# EasyEDA Pro project ProPrj_ElectronicSteatTagV6_2026-03-17.epro

# Schematic Schematic1
Create Date: 2025-06-14; Page Name: P1; Project Name: ElectronicSteatTagV6; Schematic Name: Schematic1; Update Date: 2025-07-07; Company: 嘉立创EDA; Page Size: A4; Version: V1.0
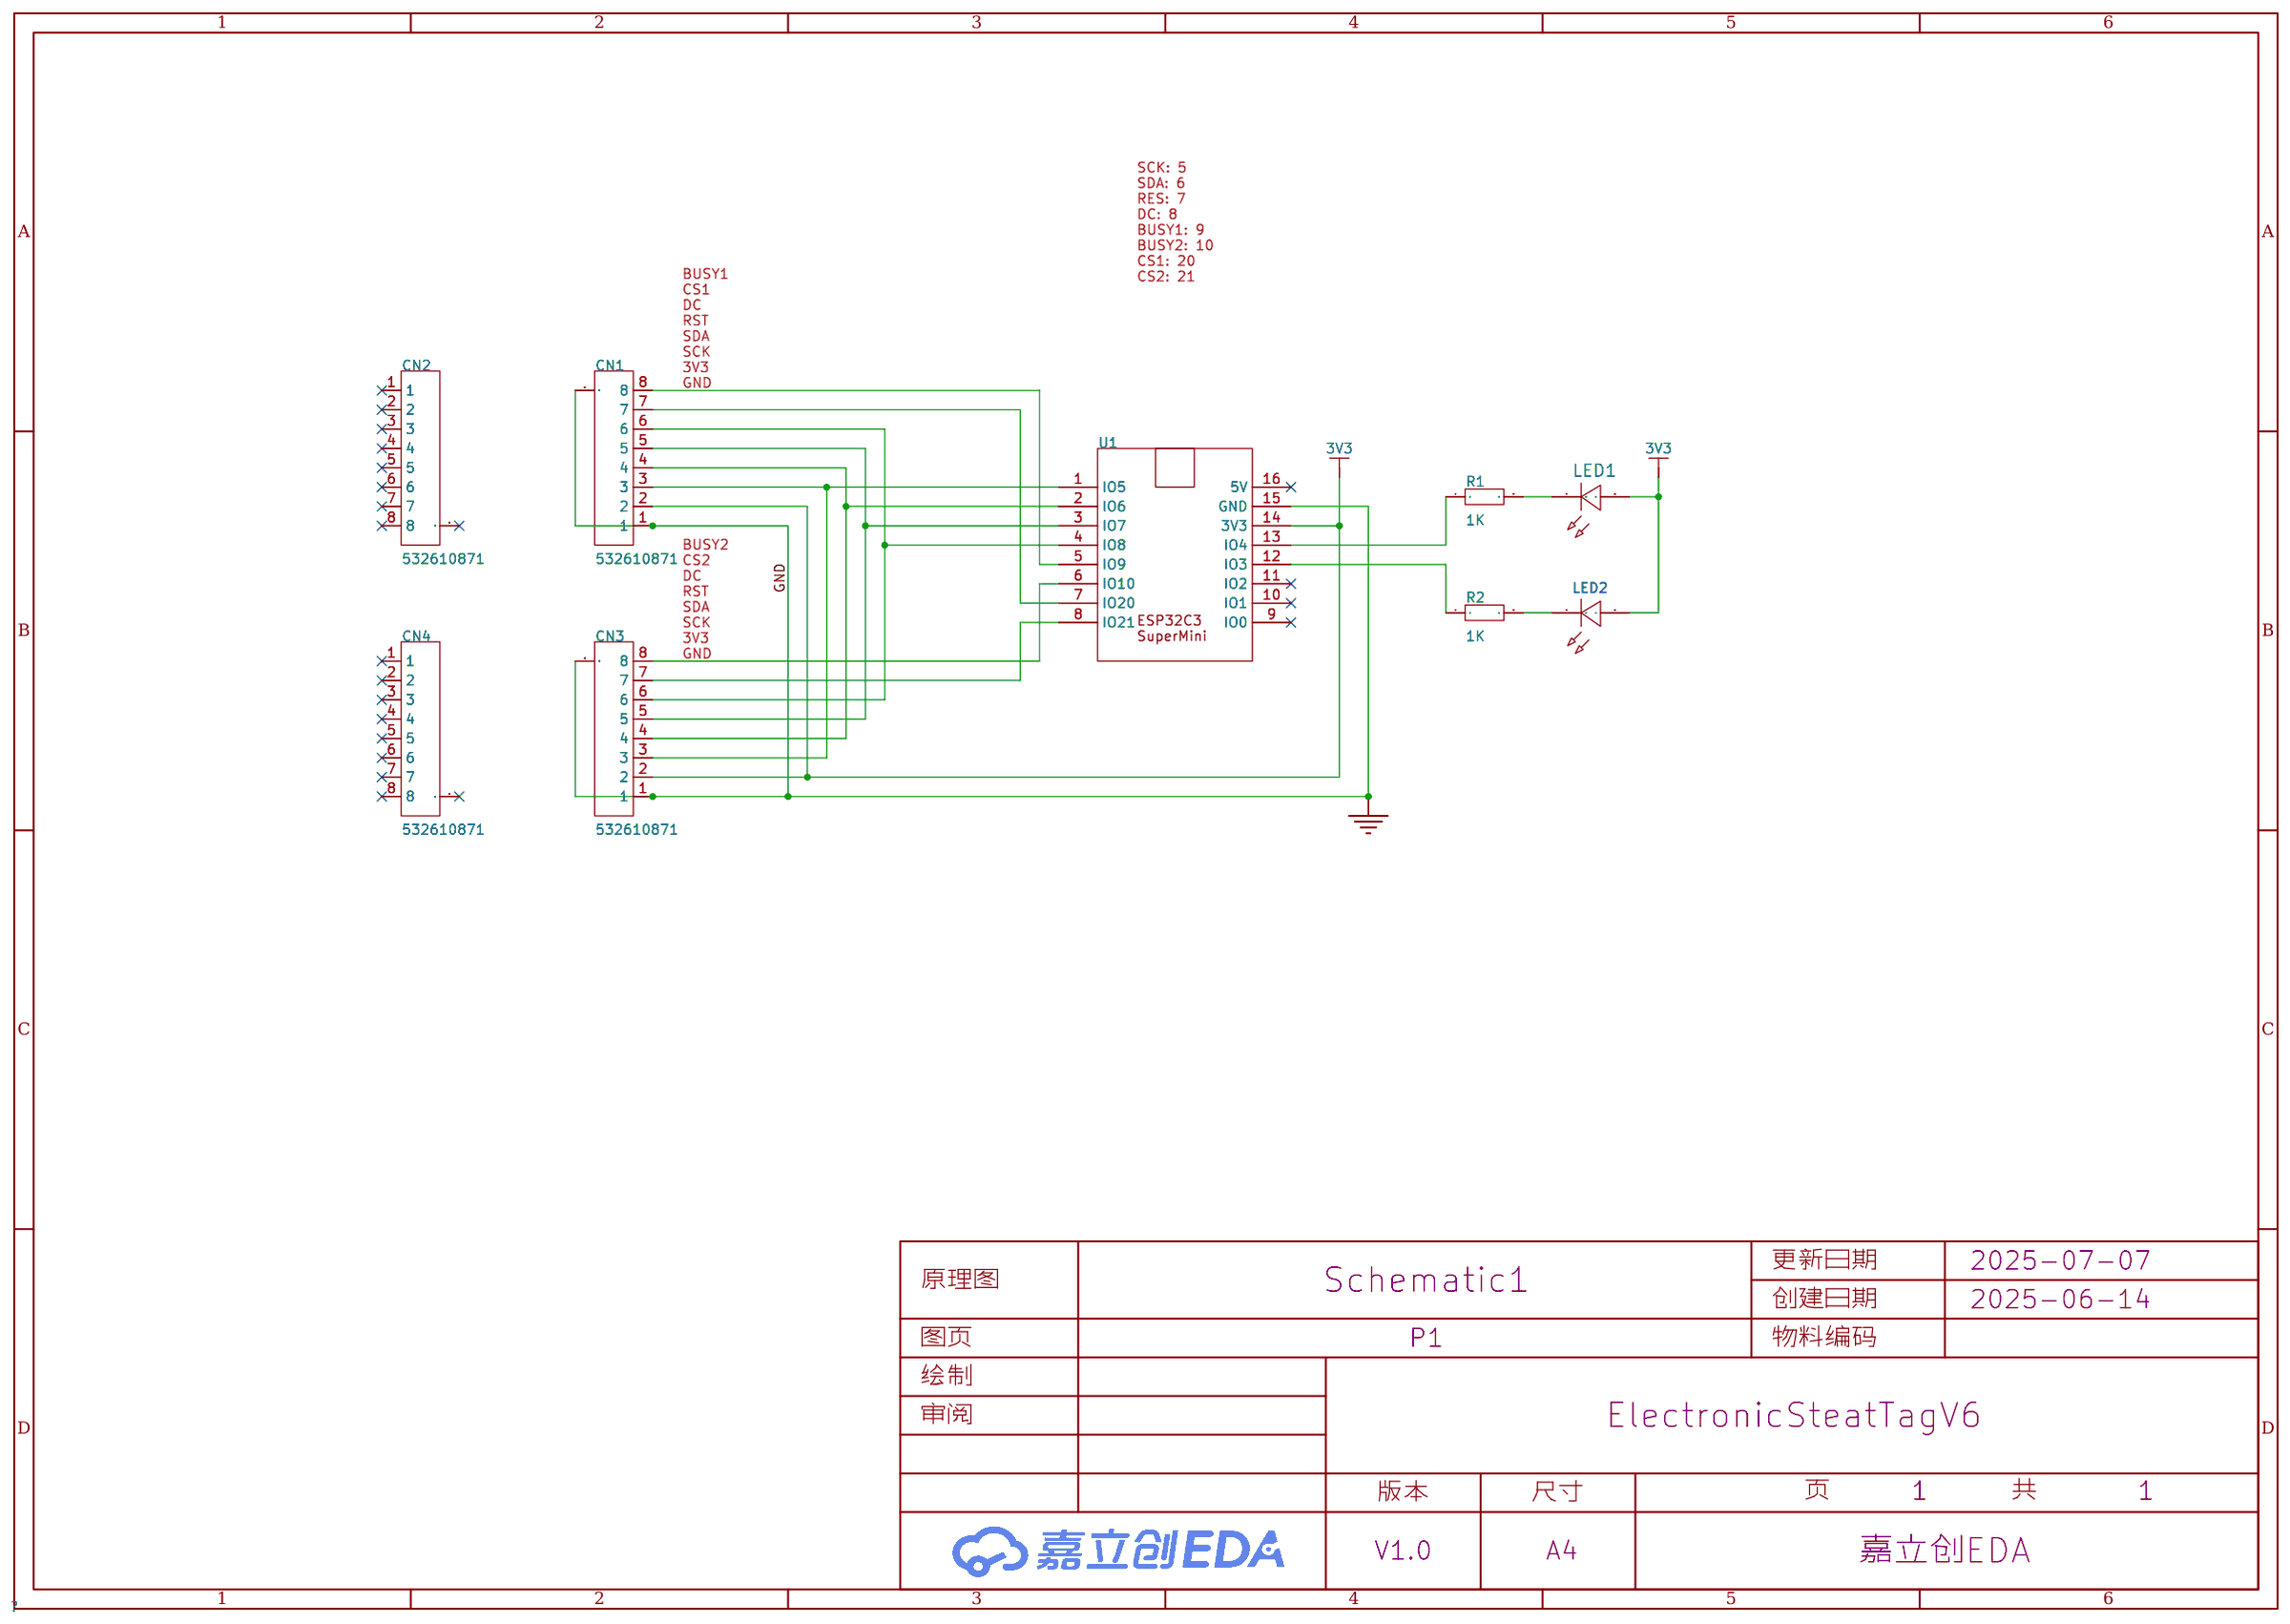
[diagram p0: schematic sheet]

## Parts
CN1  532610871  [CONN-SMD_532610871]
CN2  532610871  [CONN-SMD_532610871]
CN3  532610871  [CONN-SMD_532610871]
CN4  532610871  [CONN-SMD_532610871]
LED1  -  [LED_0805]
LED2  -  [LED_0805]
R1  1K  [R0805]
R2  1K  [R0805]
U1  -  [ESP32C3SuperMini]

## Library data of the parts
CN1-CN4 = 532610871: 插针结构:1x8P;间距:1.25mm;安装方式:卧贴;参考系列:PicoBlade(MX 1.25);总PIN数:8P;排数:1;每排PIN数:8;行距:-;额定电流:1A;触头材质:磷青铜;触头镀层:锡;工作温度:-40℃~+105℃;; LCSC Part Name: 1x8P 间距:1.25mm 卧贴 系列:PicoBlade(MX 1.25); Supplier Part: C293349; Manufacturer: MOLEX; Supplier Footprint: SMD,P=1.25mm; JLCPCB Part Class: 扩展库; Datasheet: https://www.molex.com/content/dam/molex/molex-dot-com/products/automated/en-us/salesdrawingpdf/532/53261/532610871_sd.pdf?inline\; Supplier: LCSC; Pins Structure: 1x8P; Pitch: 1.25mm; Mounting Type: 卧贴; Reference Series: PicoBlade(MX 1.25); Number of Pins: 8P; Number of Rows: 1; Number of PINs Per Row: 8; Current Rating: 1A; Contact Material: 磷青铜; Contact Plating: 锡; Operating Temperature: -40℃~+105℃; Voltage Rating: 125V; Plastic Material: 玻纤增强PA; Flame Retardant Rating: UL94V-0; Supplementary Features: 辅助焊脚; Color: 白色; Z-Height of the Board: 3.4mm; X-Length of Bottom Edge on Board (Spacing Line): 15.15mm; Y-Width of Bottom Edge on Board: 5.2mm
LED1 = LED_0805-R: Supplier Footprint: 0805
LED2 = LED_0805-B: Supplier Footprint: 0805
R1 R2 = Res_0805: Supplier Footprint: 0805
U1 = ESP32C3SuperMini

## Nets
3V3: CN1.2 CN3.2 LED1.2(A) LED2.2(A) U1.14(3V3)
GND: CN1.0 CN1.1 CN3.0 CN3.1 U1.15(GND)
$1N1581: CN1.8 U1.5(IO9)
$1N1589: CN3.8 U1.6(IO10)
$1N1597: CN3.7 U1.8(IO21)
$1N1650: CN1.3 CN3.3 U1.1(IO5)
$1N1662: CN1.5 CN3.5 U1.3(IO7)
$1N1671: CN1.6 CN3.6 U1.4(IO8)
$1N1680: CN1.7 U1.7(IO20)
$1N1928: R1.1 U1.13(IO4)
$1N1932: LED1.1(C) R1.2
$1N1940: R2.1 U1.12(IO3)
$1N1944: LED2.1(C) R2.2
$1N2158: CN1.4 CN3.4 U1.2(IO6)

Not connected (* = marked no-connect by the designer): CN2 0* 1* 2* 3* 4* 5* 6* 7* 8*; CN4 0* 1* 2* 3* 4* 5* 6* 7* 8*; U1 9(IO0)* 10(IO1)* 11(IO2)* 16(5V)*

## Notes on the sheet
- SCK: 5
  SDA: 6
  RES: 7
  DC: 8
  BUSY1: 9
  BUSY2: 10
  CS1: 20
  CS2: 21
- BUSY1
  CS1
  DC
  RST
  SDA
  SCK
  3V3
  GND
- BUSY2
  CS2
  DC
  RST
  SDA
  SCK
  3V3
  GND

# Board PCB1
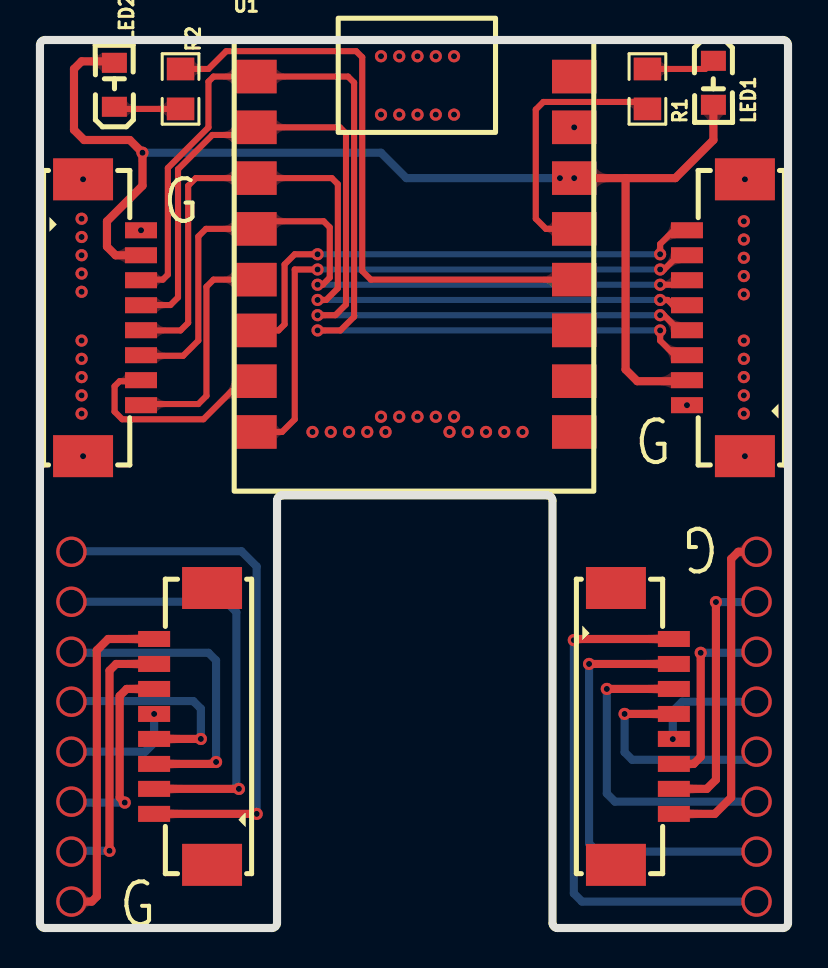
[diagram p1: board, top side]
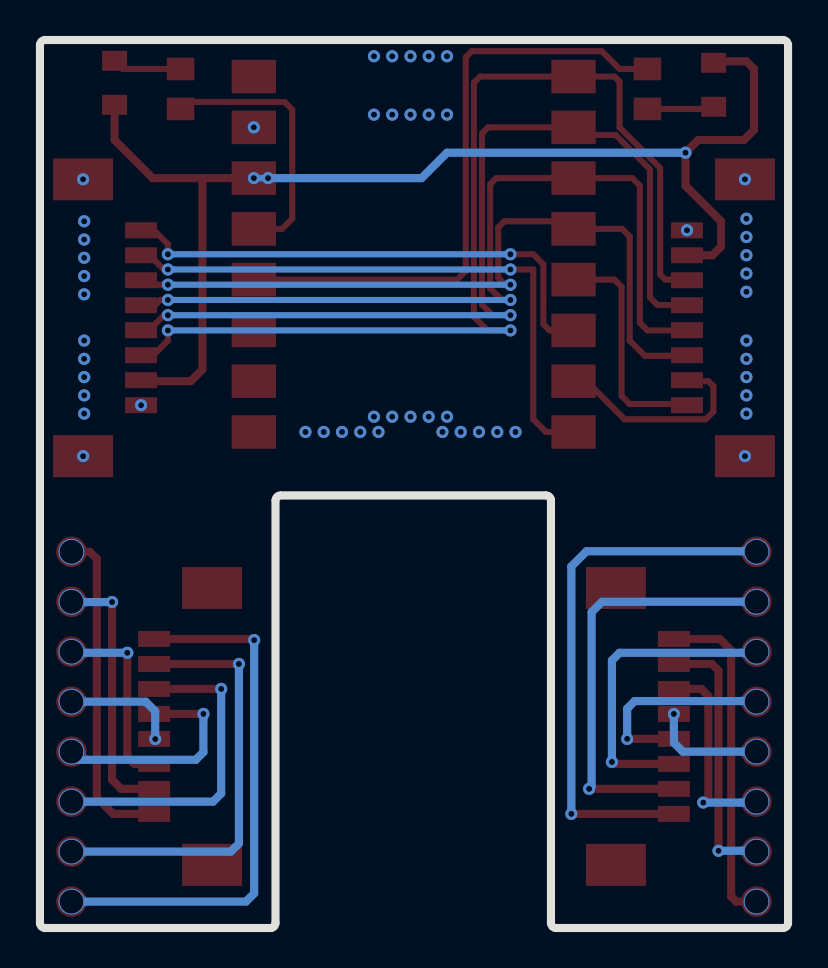
[diagram p2: board, bottom side, seen from below]

Outline 37.44 x 44.43 mm; copper layers: Top Layer, Bottom Layer. Coordinates in mm from the lower left corner of the outline.
Outline path: 0,44.17 arc(0.07,44.35) 0.25,44.43 37.19,44.43 arc(37.37,44.35) 37.44,44.17 37.44,0.25 arc(37.37,0.07) 37.19,0 25.91,0 arc(25.73,0.07) 25.65,0.25 25.65,21.39 arc(25.58,21.57) 25.4,21.64 12.12,21.64 arc(11.94,21.57) 11.87,21.39 11.87,0.25 arc(11.79,0.07) 11.61,0 0.25,0 arc(0.07,0.07) 0,0.25 0,44.17
Stack: Top Layer 0.035mm / Dielectric1 1.51mm FR4 er 4.5 / Bottom Layer 0.035mm

## Design rules (mm)
template: JLCPCB Capability(Two Layers Board)
spacing copperThickness1oz (default): track to track 0.102, other pairs 0.152 to 0.3
spacing copperThickness2oz: track to track 0.203, other pairs 0.152 to 0.3
track width copperThickness1oz (default): min 0.127, default 0.254, max 2.54
track width copperThickness2oz: min 0.203, default 0.254, max 2.54
differential pair differentialPair (default): width min 0.127, default 0.254, max 2.54; gap min 0.152, default 0.152
via viaSize (default): diameter min 0.5, default 0.61, max 10; hole min 0.3, default 0.305, max 6.3

## Placement (name value [footprint] x y rotation side)
CN1  532610871  [CONN-SMD_532610871]  3.61 30.53 270 top
CN2  532610871  [CONN-SMD_532610871]  7.16 10.09 90 top
CN3  532610871  [CONN-SMD_532610871]  33.83 30.53 90 top
CN4  532610871  [CONN-SMD_532610871]  30.28 10.09 270 top
LED1  -  [LED_0805]  33.7 42.23 270 top
LED2  -  [LED_0805]  3.73 42.23 90 top
NOREF  -  [Pad_e14]  1.58 16.32 0 top
NOREF#2  -  [Pad_e20]  1.58 8.82 0 top
NOREF#3  -  [Pad_e38]  35.87 6.32 0 top
NOREF#4  -  [Pad_e28]  35.87 18.82 0 top
NOREF#5  -  [Pad_e42]  35.87 1.32 0 top
NOREF#6  -  [Pad_e24]  1.58 3.82 0 top
NOREF#7  -  [Pad_e12]  1.58 18.82 0 top
NOREF#8  -  [Pad_e36]  35.87 8.82 0 top
NOREF#9  -  [Pad_e34]  35.87 11.32 0 top
NOREF#10  -  [Pad_e18]  1.58 11.32 0 top
NOREF#11  -  [Pad_e40]  35.87 3.82 0 top
NOREF#12  -  [Pad_e16]  1.58 13.82 0 top
NOREF#13  -  [Pad_e22]  1.58 6.32 0 top
NOREF#14  -  [Pad_e30]  35.87 16.32 0 top
NOREF#15  -  [Pad_e26]  1.58 1.32 0 top
NOREF#16  -  [Pad_e32]  35.87 13.82 0 top
R1  1K  [R0805]  30.41 41.98 90 top
R2  1K  [R0805]  7.04 41.98 270 top
U1  -  [ESP32C3SuperMini]  9.72 44.38 0 top

## Footprints (pads in the part's own frame, mm; a bottom-side part is the same pattern mirrored in y, then rotated)
CONN-SMD_532610871
  rect 2.1x3 smd: 0(-6.925,-1.45) 0(6.925,-1.45)
  rect 0.8x1.6 smd: 1(-4.375,1.45) 2(-3.125,1.45) 3(-1.875,1.45) 4(-0.625,1.45) 5(0.625,1.45) 6(1.875,1.45) 7(3.125,1.45) 8(4.375,1.45)
ESP32C3SuperMini
  rect 2.22x1.68 smd: 1(1.016,-1.778) 2(1.016,-4.318) 3(1.016,-6.858) 4(1.016,-9.398) 5(1.016,-11.938) 6(1.016,-14.478) 7(1.016,-17.018) 8(1.016,-19.558) 9(17.018,-19.558) 10(17.018,-17.018) 11(17.018,-14.478) 12(17.018,-11.938) 13(17.018,-9.398) 14(17.018,-6.858) 15(17.018,-4.318) 16(17.018,-1.778)
LED_0805
  rect 1x1.25 smd: 1(-1.15,0.005) 2(1.05,0.005)
Pad_e12
  round 1.524 smd: 0(0,0)
Pad_e14
  round 1.524 smd: 4(0,0)
Pad_e16
  round 1.524 smd: 0(0,0)
Pad_e18
  round 1.524 smd: 2(0,0)
Pad_e20
  round 1.524 smd: 1(0,0)
Pad_e22
  round 1.524 smd: 6(0,0)
Pad_e24
  round 1.524 smd: 5(0,0)
Pad_e26
  round 1.524 smd: 3(0,0)
Pad_e28
  round 1.524 smd: 0(0,0)
Pad_e30
  round 1.524 smd: 4(0,0)
Pad_e32
  round 1.524 smd: 0(0,0)
Pad_e34
  round 1.524 smd: 2(0,0)
Pad_e36
  round 1.524 smd: 1(0,0)
Pad_e38
  round 1.524 smd: 6(0,0)
Pad_e40
  round 1.524 smd: 5(0,0)
Pad_e42
  round 1.524 smd: 3(0,0)
R0805
  rect 1.133x1.377 smd: 1(-1,0) 2(1,0)

## Nets
As in the schematic.

Pads without a net: CN2 0 1 2 3 4 5 6 7 8; CN4 0 1 2 3 4 5 6 7 8; NOREF 4; NOREF#2 1; NOREF#3 6; NOREF#4 0; NOREF#5 3; NOREF#6 5; NOREF#7 0; NOREF#8 1; NOREF#9 2; NOREF#10 2; NOREF#11 5; NOREF#12 0; NOREF#13 6; NOREF#14 4; NOREF#15 3; NOREF#16 0; U1 9 10 11 16

## Via types
v1: diameter 1.3, hole 1.2, Top Layer to Bottom Layer, 16 vias
v2: diameter 0.61, hole 0.305, Top Layer to Bottom Layer, 81 vias

## Routing (per net, layer and track width the routed paths; a pad name or vN(x,y) marks a point on that pad's centre or on a via; arc(x,y) is an arc through that point)
3V3: length 61
  Top Layer w0.406: CN3.2 32.33,27.36 29.9,27.36 29.31,27.94 29.31,37.52 ; CN1.2 3.79,33.66 3.35,34.09 3.35,35.36 5.13,37.14 v2(5.13,38.79) 4.5,39.42 2.21,39.42 1.7,39.93 1.7,42.98 2.08,43.36 3.65,43.36 LED2.2 ; v2(26.74,37.52) 29.31,37.52 ; 29.31,37.52 31.8,37.52 33.71,39.42 LED1.2
  Bottom Layer w0.305: v2(26.03,37.52) v2(26.74,37.52)
  Bottom Layer w0.406: v2(5.13,38.79) 17.07,38.79 18.34,37.52 v2(26.03,37.52)
GND:
  vias: v2(2.16,37.46) v2(2.08,35.49) v2(2.08,34.57) v2(2.08,33.66) v2(2.08,32.74) v2(2.08,31.83) v2(2.08,29.39) v2(2.08,28.48) v2(2.08,27.56) v2(2.08,26.65) v2(2.08,25.73) v2(2.16,23.61) v2(5.06,34.91) v2(13.64,24.82) v2(14.56,24.82) v2(15.47,24.82) v2(16.38,24.82) v2(17.07,43.61) v2(17.07,40.69) v2(17.07,25.58) v2(17.3,24.82) v2(17.98,43.61) v2(17.98,40.69) v2(17.98,25.58) v2(18.9,43.61) v2(18.9,40.69) v2(18.9,25.58) v2(19.81,43.61) v2(19.81,40.69) v2(19.81,25.58) v2(20.5,24.82) v2(20.73,43.61) v2(20.73,40.69) v2(20.73,25.58) v2(21.41,24.82) v2(22.33,24.82) v2(23.24,24.82) v2(24.16,24.82) v2(26.74,40.06) v2(32.38,26.16) v2(35.23,35.36) v2(35.23,34.44) v2(35.23,33.53) v2(35.23,32.62) v2(35.23,31.7) v2(35.23,29.39) v2(35.23,28.48) v2(35.23,27.56) v2(35.23,26.65) v2(35.23,25.73) v2(35.28,37.46) v2(35.28,23.61)
(no net): length 242.2
  Top Layer w0.406: v2(33.07,13.77) 33.07,8.56 32.72,8.21 CN4.6 ; CN4.8 33.78,5.71 34.6,6.53 34.6,18.47 34.95,18.82 v1(35.87,18.82) ; 5.71,8.21 8.72,8.21 v2(8.82,8.31) ; 5.71,13.21 3.81,13.21 3.48,12.88 v2(3.48,3.86) ; 5.71,14.46 3.41,14.46 2.85,13.9 2.85,1.58 2.59,1.32 v1(1.58,1.32) ; CN4.1 26.78,14.46 v2(26.72,14.4) ; CN4.7 33.38,6.96 33.83,7.42 v2(33.83,16.31) ; 5.71,9.46 v2(8.05,9.46) ; v2(31.68,9.45) 31.72,9.45 CN4.5 ; 5.71,11.96 4.34,11.96 3.99,11.61 3.99,6.53 v2(4.24,6.28) ; CN4.4 v2(29.26,10.71) ; CN4.3 v2(28.37,11.96) ; 5.71,6.96 v2(9.96,6.96) ; CN4.2 v2(27.48,13.21) ; 5.71,5.71 v2(10.85,5.71)
  Bottom Layer w0.406: v2(4.24,6.28) 1.62,6.28 v1(1.58,6.32) ; v2(5.71,10.71) 5.71,9.27 5.27,8.82 v1(1.58,8.82) ; v1(35.87,6.32) 28.78,6.32 28.37,6.73 v2(28.37,11.96) ; v1(35.87,1.32) 27.13,1.32 26.72,1.73 v2(26.72,14.4) ; v2(33.83,16.31) 35.85,16.31 v1(35.87,16.32) ; v2(31.68,9.45) 31.68,10.85 32.15,11.32 v1(35.87,11.32) ; v2(33.07,13.77) 35.81,13.77 v1(35.87,13.82) ; v2(3.48,3.86) 1.62,3.86 v1(1.58,3.82) ; v2(29.26,10.71) 29.26,8.8 29.64,8.42 35.46,8.42 v1(35.87,8.82) ; v2(8.05,9.46) 8.05,10.97 7.67,11.36 1.61,11.36 v1(1.58,11.32) ; v2(10.85,5.71) 10.85,18.09 10.09,18.85 1.6,18.85 v1(1.58,18.82) ; v2(27.48,13.21) 27.48,4.23 27.89,3.82 v1(35.87,3.82) ; v1(1.58,13.82) 1.63,13.77 8.43,13.77 8.82,13.39 v2(8.82,8.31) ; v1(1.58,16.32) 9.31,16.32 9.83,15.8 9.83,7.09 v2(9.96,6.96)
$1N1581: length 11.5
  Top Layer w0.305: CN1.8 5.12,26.21 7.93,26.21 8.33,26.62 8.33,32.08 8.69,32.44 U1.5
$1N1589: length 25.8
  Top Layer w0.305: v2(31.04,33.71) 31.04,34.22 31.73,34.91 CN3.8 ; U1.6 11.94,29.9 12.24,30.2 12.24,33.2 12.75,33.71 v2(13.9,33.71)
  Bottom Layer w0.305: v2(31.04,33.71) v2(13.9,33.71)
$1N1597: length 29.7
  Top Layer w0.305: CN3.7 31.95,33.66 31.24,32.95 v2(31.04,32.95) ; U1.8 12.12,24.82 12.75,25.45 12.75,32.95 v2(13.9,32.95)
  Bottom Layer w0.305: v2(31.04,32.95) v2(13.9,32.95)
$1N1650: length 52.6
  Top Layer w0.305: CN3.3 31.77,28.66 31.04,29.39 v2(31.04,29.9) ; CN1.3 5.09,32.44 6.15,32.44 6.4,32.69 6.4,38.02 8.43,40.06 8.43,42.34 8.69,42.6 U1.1 15.42,42.6 15.72,42.29 15.72,30.58 15.04,29.9 v2(13.9,29.9)
  Bottom Layer w0.305: v2(31.04,29.9) v2(13.9,29.9)
$1N1662: length 42.2
  Top Layer w0.305: CN3.5 31.69,31.16 31.42,31.42 v2(31.04,31.42) ; v2(13.9,31.42) 14.33,31.42 14.91,32.01 14.91,37.21 14.61,37.52 U1.3 7.8,37.52 7.42,37.14 7.42,30.28 7.04,29.9 5.07,29.9 CN1.5
  Bottom Layer w0.305: v2(31.04,31.42) v2(13.9,31.42)
$1N1671: length 37.3
  Top Layer w0.305: v2(13.9,32.18) 14.15,32.18 14.51,32.54 14.51,35.05 14.2,35.36 11.12,35.36 U1.4 8.31,34.98 7.93,34.6 7.93,29.39 7.16,28.63 5.09,28.63 CN1.6 ; v2(31.04,32.18) 32.16,32.18 CN3.6
  Bottom Layer w0.305: v2(31.04,32.18) v2(13.9,32.18)
$1N1680: length 10.7
  Top Layer w0.305: U1.7 10.09,27.36 8.18,25.45 4.12,25.45 3.74,25.83 3.74,27.1 3.99,27.36 5.01,27.36 CN1.7
$1N1928: length 13.5
  Top Layer w0.305: U1.13 25.33,34.98 24.82,35.49 24.82,40.95 25.2,41.33 30.06,41.33 R1.1
$1N1932: length 3.5
  Top Layer w0.305: R1.2 33.3,42.98 LED1.1
$1N1940: length 31.1
  Top Layer w0.305: R2.1 8.43,42.98 9.32,43.87 15.83,43.87 16.13,43.56 16.13,32.87 16.56,32.44 U1.12
$1N1944: length 3.4
  Top Layer w0.305: LED2.1 3.83,40.98 R2.2
$1N2158: length 46.8
  Top Layer w0.305: v2(13.9,30.66) 14.78,30.66 15.32,31.19 15.32,39.75 15.01,40.06 U1.2 10.36,39.68 8.63,39.68 6.91,37.96 6.91,31.55 6.53,31.17 5.07,31.17 CN1.4 ; v2(31.04,30.66) 31.23,30.66 31.98,29.91 CN3.4
  Bottom Layer w0.305: v2(31.04,30.66) v2(13.9,30.66)

## Copper pours and planes (outline as drawn; the poured copper is in the pictures)
GND on Top Layer: -1.34,45.52 38.53,45.52 38.53,21.64 -1.34,21.64
GND on Bottom Layer: -2.87,46.66 39.55,46.66 39.55,21.64 -2.87,21.64

Small or netless copper shapes (teardrops, artwork), in the pictures only: 78 on Top Layer, 45 on Bottom Layer

## Text on the board
Top Silkscreen Layer: G
